# Altium schematic sheet new_amp.SchDoc
size A4; SheetNumber: 3; SheetTotal: 3
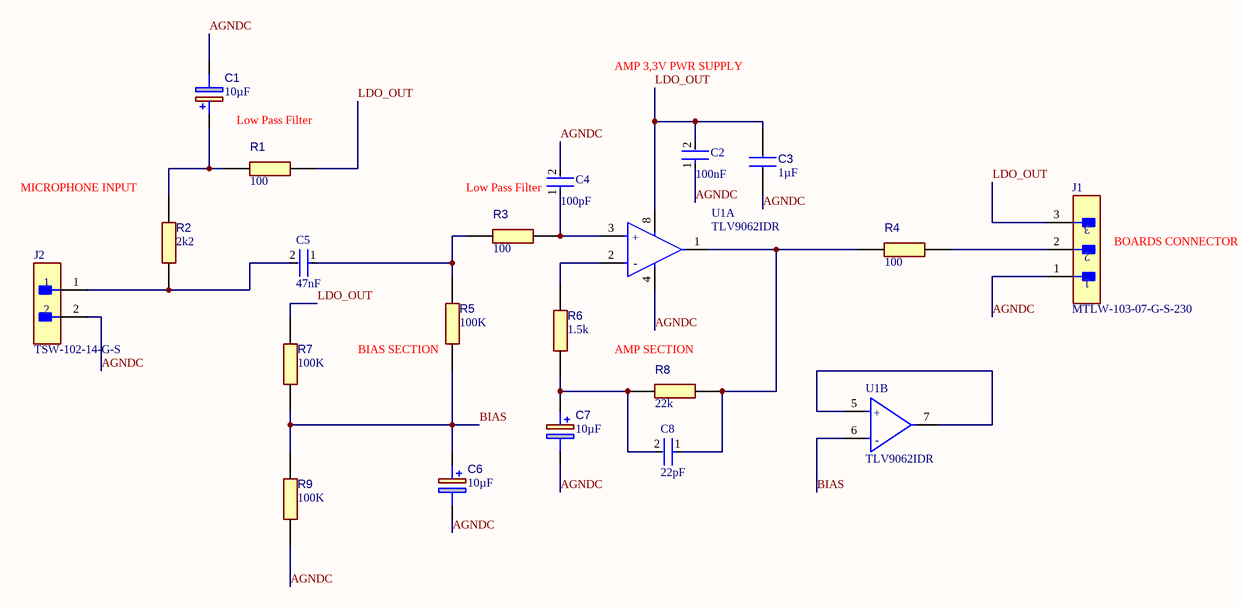
[diagram p0: new_amp.SchDoc]

## Parts
C1  value 10µF  [593D106X9016B2TE3-Footprint-1]  (hidden comment: 593D106X9016B2TE3)
C2  Capacitance: 100nF  [FP-0805B-IPC_C]  (hidden comment: 0805B104K500CT)
C3  value 1µF  [08055C105KAT2A-Footprint-1]  (hidden comment: 08055C105KAT2A)
C4  Capacitance: 100pF  [FP-0805B-IPC_C]  (hidden comment: 0805B104K500CT)
C5  Capacitance: 47nF  [FP-0805B-IPC_C]  (hidden comment: 0805B104K500CT)
C6  value 10µF  [593D106X9016B2TE3-Footprint-1]  (hidden comment: 593D106X9016B2TE3)
C7  value 10µF  [593D106X9016B2TE3-Footprint-1]  (hidden comment: 593D106X9016B2TE3)
C8  Capacitance: 22pF  [FP-0805B-IPC_C]  (hidden comment: 0805B104K500CT)
J1  MTLW-103-07-G-S-230  [FP-MTLW-103-07-G-S-230-MFG]
J2  TSW-102-14-G-S  [FP-TSW-102-14-G-S-MFG]
R1  value 100  [AR05BTCW1501-Footprint-1]  (hidden comment: AR05BTCW1501)
R2  value 2k2  [AR05BTCW1501-Footprint-1]  (hidden comment: AR05BTCW1501)
R3  value 100  [AR05BTCW1501-Footprint-1]  (hidden comment: AR05BTCW1501)
R4  value 100  [AR05BTCW1501-Footprint-1]  (hidden comment: AR05BTCW1501)
R5  value 100K  [AR05BTCW1501-Footprint-1]  (hidden comment: AR05BTCW1501)
R6  value 1.5k  [AR05BTCW1501-Footprint-1]  (hidden comment: AR05BTCW1501)
R7  value 100K  [AR05BTCW1501-Footprint-1]  (hidden comment: AR05BTCW1501)
R8  value 22k  [AR05BTCW1501-Footprint-1]  (hidden comment: AR05BTCW1501)
R9  value 100K  [AR05BTCW1501-Footprint-1]  (hidden comment: AR05BTCW1501)
U1  TLV9062IDR  [FP-D0008A-MFG]  (parts A,B of 2)

## Nets
AGNDC: C1.2(-) C2.1 C3.1 C4.2 C6.2(-) C7.2(-) J1.1 J2.2 R9.2 U1.4(V-)
BIAS: C6.1(+) R5.2 R7.2 R9.1 U1.6(IN2-)
LDO_OUT: C2.2 C3.2 J1.3 R1.1 R7.1 U1.8(V+)
NetC1_1: C1.1(+) R1.2 R2.1
NetC4_1: C4.1 R3.1 U1.3(IN1+)
NetC5_1: C5.1 R3.2 R5.1
NetC5_2: C5.2 J2.1 R2.2
NetC7_1: C7.1(+) C8.2 R6.1 R8.2
NetC8_1: C8.1 R4.2 R8.1 U1.1(OUT1)
NetJ1_2: J1.2 R4.1
NetR6_2: R6.2 U1.2(IN1-)
NetU1_5: U1.5(IN2+) U1.7(OUT2)

## Notes on the sheet
- AMP 3,3V PWR SUPPLY
- Low Pass Filter
- MICROPHONE INPUT
- (near C4) Low Pass Filter
- (near J1) BOARDS CONNECTOR
- (near R5) BIAS SECTION
- AMP SECTION
- (in symbol CMP-04895-000302-1, part A) +; -
- (in symbol CMP-04895-000302-1, part B) +; -

## Library data of the parts
C1 C6 C7 = CMP-001-00089-1: Cap Tant Solid 10uF 16V B CASE 10% (3.5 X 2.8 X 1.9mm) Inward L SMD 3528-21 0.8 Ohm 125C T/R; Ripple Current: 132mA; Pins: 2; Case/Package: 1411; Voltage Rating: 16V; Min Operating Temperature: -55°C; Max Operating Temperature: 125°C; Tolerance: 10%; Mounting Technology: Surface Mount
C2 C4 C5 C8 = CMP-45632-000003-1: CAP CER 0.1UF 50V X7R 0805; Tolerance: 10%; RoHS Compliant: Yes; Packaging: Tape and Reel; Voltage Rating (DC): 50V; Voltage Rating: 50V; Length: 2mm; Lead Free: Lead Free; Voltage: 50V; Case/Package: 0805; Case Code (Metric): 2012; Depth: 1.25mm; Min Operating Temperature: -55°C; Case Code (Imperial): 0805; Max Operating Temperature: 125°C; Radiation Hardening: No; Dielectric: X7R
C3 = CMP-001-00087-1: 0805 Standard 1UF Ceramic Multilayer Capacitor, 50V, +125C, X7R Dielectric, +/-10%; Tolerance: 10%; Mounting Technology: Surface Mount; Min Operating Temperature: -55°C; Case/Package: 0805; Max Operating Temperature: 125°C; Voltage Rating: 50V
J1 = CMP-02766-001679-1: CONN HEADER VERT 3POS 2.54MM; Max Current Rating: 3A; Number of Contacts: 3; Gender: Male; Contact Material: Bronze; Pitch: 2.54mm; Housing Material: Polymer; Contact Plating: Gold; Radiation Hardening: No; Depth: 2.48mm; Packaging: Bulk; Number of Rows: 1; Max Operating Temperature: 125°C; Housing Color: Black; Termination: Solder; Min Operating Temperature: -55°C; Length: 7.62mm; RoHS Compliant: Yes; Orientation: Straight
J2 = CMP-02766-001740-1: CONN HEADER VERT 2POS 2.54MM; Number of Positions: 2; Max Current Rating: 7.6A; Gender: Male; Max Voltage Rating (AC): 550V; Contact Mating Length: 0.32inch; REACH SVHC: No SVHC; Width: 2.54mm; Insulation Material: PBT; Contact Shape: Square; Contact Plating: Gold; Min Operating Temperature: -55°C; Contact Material: Bronze; Color: Black; Number of Contacts: 2; Housing Material: Polyester; Orientation: Straight; Flammability Rating: UL94 V-0; Max Operating Temperature: 125°C; Contact Type: Male Pin; Radiation Hardening: No; Termination: Solder; RoHS Compliant: Yes; Lead Free: Lead Free; Fastening Type: Pull; Pitch: 2.54mm; Number of Rows: 1; Series: TSW; Insulation Color: Black; Package Quantity: 1; Connector Type: Header; Length: 5.08mm; Contact Finish - Mating: GOLD; Mount: Through Hole; Housing Color: Black; Depth: 2.54mm; Packaging: Bulk
R1-R9 = CMP-009-00182-1: 125mW Thin Film Resistor 100V ±25ppm/℃ ±0.1% 1.5kΩ 0805 Chip Resistor - Surface Mount ROHS; Mounting Technology: Surface Mount; Min Operating Temperature: -55°C; Tolerance: 0.1%; Max Operating Temperature: 155°C; Case/Package: 0805
U1 = CMP-04895-000302-1: IC CMOS 2 CIRCUIT 8SOIC; Slew Rate: 6.5V/µs; Number of Channels: 2; Input Offset Voltage (Vos): 300uV; Input Bias Current: 0.5pA; Output Current per Channel: 50mA; Gain Bandwidth Product: 10MHz; Operating Supply Current: 538uA; RoHS Compliant: Yes; Case/Package: SOIC; Number of Circuits: 2; Number of Pins: 8; Mount: Surface Mount; Max Operating Temperature: 125°C; Min Operating Temperature: -40°C; Packaging: Tape and Reel